# EAGLE design 3w developer v6 (EAGLE 5.12)
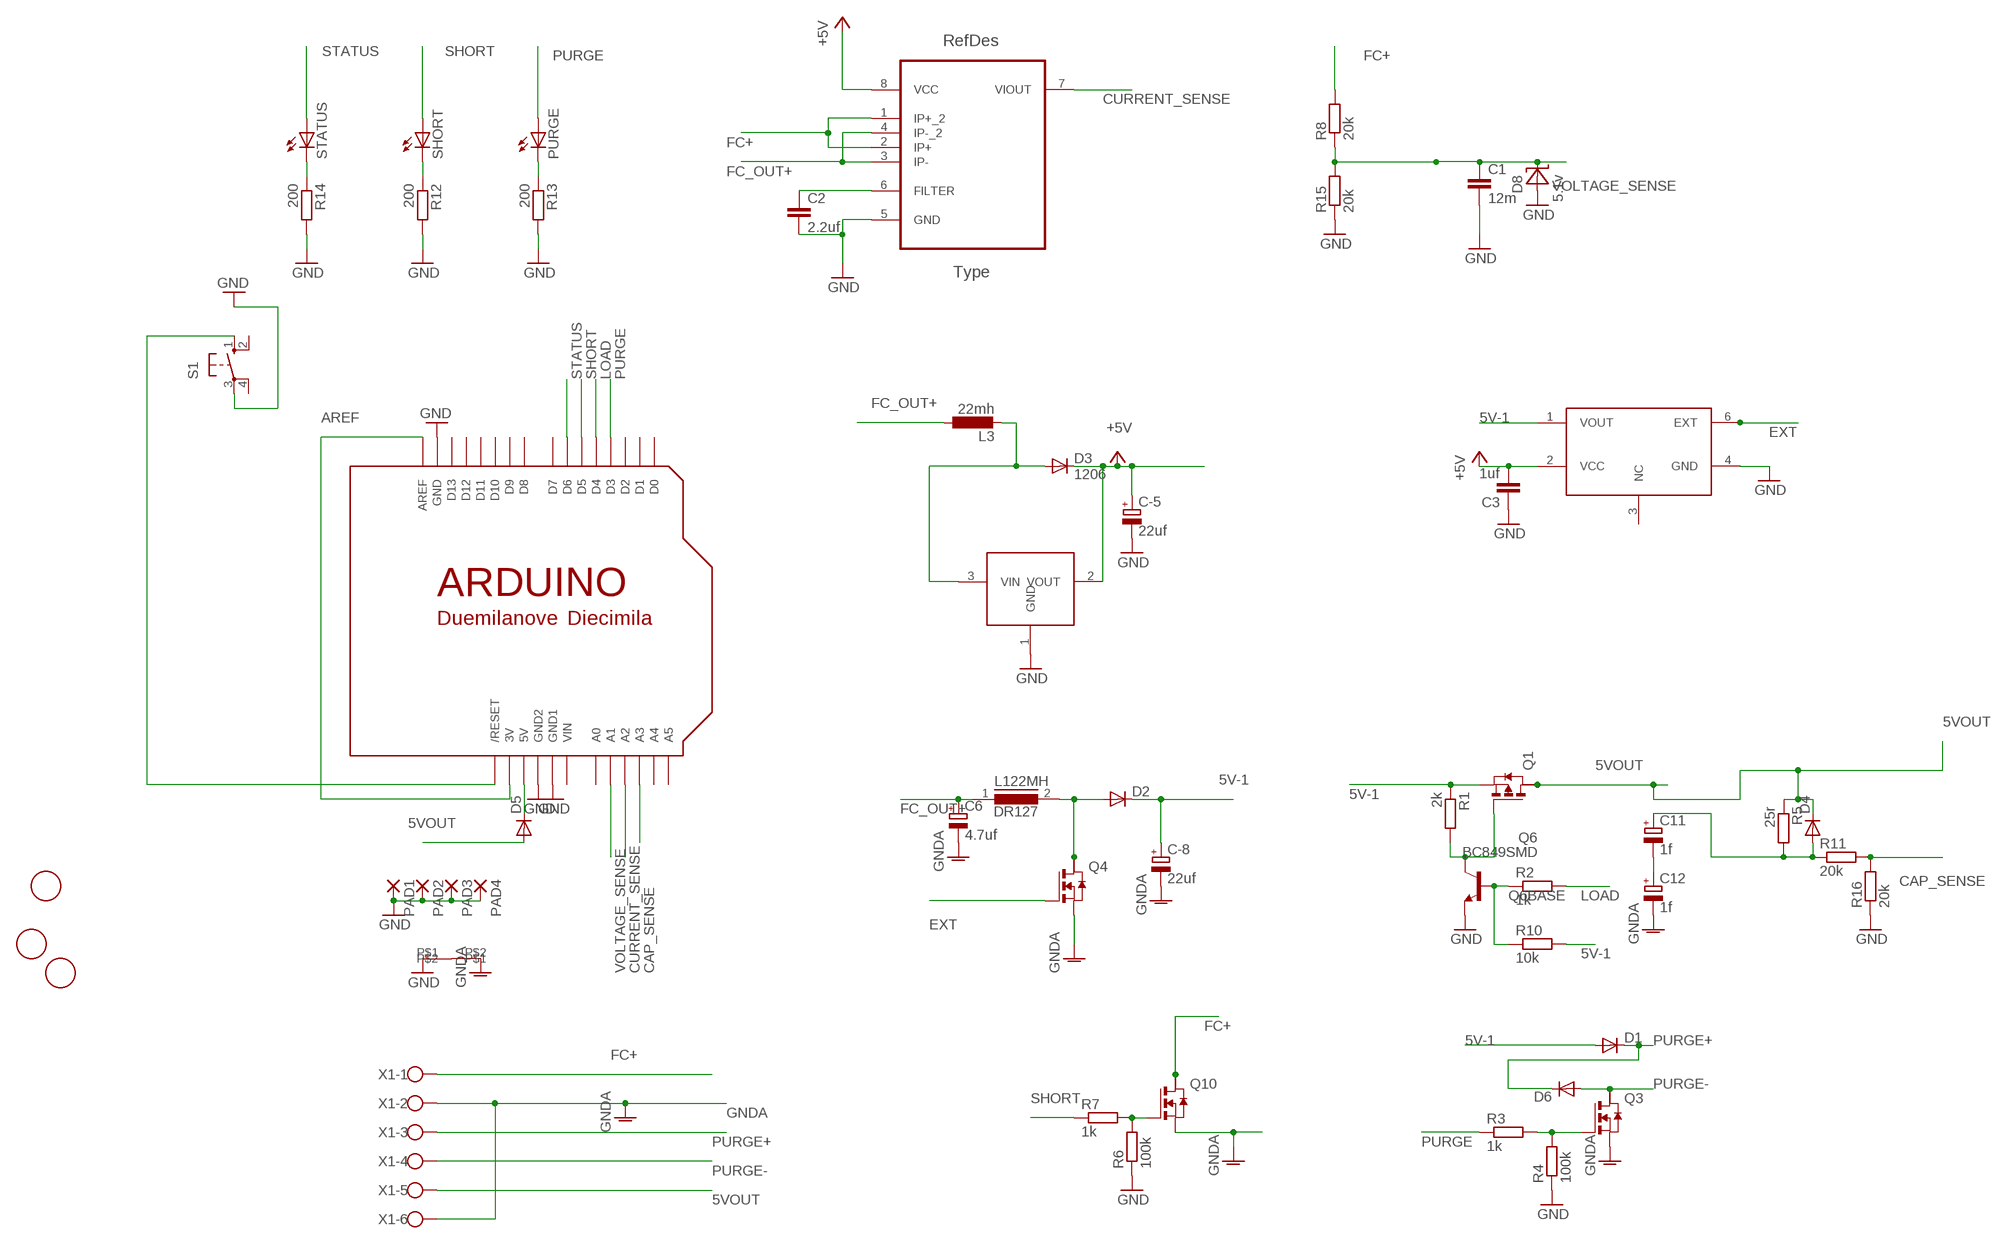
[diagram p0: schematic, sheet 1]

## Parts
C1  12m  C-EUC1206  [C1206]
C2  2.2uf  C-EUC1206  [C1206]
C3  1uf  C-EUC1206  [C1206]
C6  4.7uf  CPOL-EUSMCC  [SMC_C]
C11  1f  CPOL-EUE5-10.5  [E5-10,5]
C12  1f  CPOL-EUE5-10.5  [E5-10,5]
C-5  22uf  CPOL-EUSMCD  [SMC_D]
C-8  22uf  CPOL-EUSMCD  [SMC_D]
D1  DIODE-DO214AA  [DO214AA]
D2  DIODE-DO214BA  [DO214BA]
D3  1206  DIODE-DO214BA  [DO214BA]
D4  DIODE-DO214BA  [DO214BA]
D5  DIODE-DO214BA  [DO214BA]
D6  DIODE-DO214AA  [DO214AA]
D8  5.1v  1206ZENER  [C1206]
L3  22mh  L-EU  [MURATA-45223]
L122MH  DR127  [DR127]
PAD1  1,6/0,8  [1,6/0,8]
PAD2  1,6/0,8  [1,6/0,8]
PAD3  1,6/0,8  [1,6/0,8]
PAD4  1,6/0,8  [1,6/0,8]
PURGE  LEDSMT1206  [1206]
Q1  PMOSSOT223  [SOT223]
Q3  NMOSSOT223  [SOT223]
Q4  NMOSSOT223  [SOT223]
Q6  BC849SMD  [SOT23-BEC]
Q10  NMOSSOT223  [SOT223]
R1  2k  R-EU_M1206  [M1206]
R2  1k  R-EU_M1206  [M1206]
R3  1k  R-EU_M1206  [M1206]
R4  100k  R-EU_M1206  [M1206]
R5  25r  R-EU_R2512  [R2512]
R6  100k  R-EU_M1206  [M1206]
R7  1k  R-EU_M1206  [M1206]
R8  20k  R-EU_R1206  [R1206]
R10  10k  R-EU_M1206  [M1206]
R11  20k  R-EU_M1206  [M1206]
R12  200  R-EU_M1206  [M1206]
R13  200  R-EU_M1206  [M1206]
R14  200  R-EU_M1206  [M1206]
R15  20k  R-EU_R1206  [R1206]
R16  20k  R-EU_M1206  [M1206]
S1  10-XX  [B3F-10XX]
SHORT  LEDSMT1206  [1206]
STATUS  LEDSMT1206  [1206]
U$2  FIDUCIAL  [FIDUCIAL_1MM]
U$3  ARDUINO-NOHOLE  [ARDUINO-NOHOLE]
U$4  SHORT  [SHORT]
U$5  FIDUCIAL  [FIDUCIAL_1MM]
U$6  FIDUCIAL  [FIDUCIAL_1MM]
UC1  MINIPAK-7750  [SOT89]
UC2  MINIPAK-E50  [SOT23-5]
UC3  ACS712ELCTR-05B-T  [SOIC127P600X175-8N]
X1  W237-6  [W237-6]

## Nets
5V-1: C-8.+ D1.A D2.C Q1.3(S) R1.1 R10.2 UC2.1(VOUT)
5VOUT [power]: D4.C D5.A Q1.2(D) R5.1 X1.5
+5V [medpower]: C3.2 C-5.+ D3.C UC1.2(VOUT) UC2.2(VCC) UC3.8(VCC)
AREF: U$3.3V U$3.AREF
CAP_SENSE: R11.2 R16.2 U$3.A3
CURRENT_SENSE: U$3.A2 UC3.7(VIOUT)
EXT: Q4.1(G) UC2.6(EXT)
FC+ [power]: Q10.2(D) R8.2 UC3.1(IP+_2) UC3.2(IP+) X1.1
FC_OUT+ [power]: C6.+ L3.P$1 L122MH.1 UC3.3(IP-) UC3.4(IP-_2)
GND: C1.2 C2.2 C3.1 C-5.- D8.ANODE(A) PAD1.1(P) PAD2.1(P) PAD3.1(P) PAD4.1(P) Q6.E R4.1 R6.1 R12.2 R13.2 R14.2 R15.1 R16.1 S1.3(P) U$3.GND U$3.GND1 U$3.GND2 U$4.P$1 UC1.1(GND) UC2.4(GND) UC3.5(GND)
GNDA [power]: C6.- C12.- C-8.- Q3.3(S) Q4.3(S) Q10.3(S) U$4.P$2 X1.2 X1.6
LOAD: R2.2 U$3.D4
N$1: Q10.1(G) R6.2 R7.2
N$2: Q1.1(G) Q6.C R1.2
N$3: D2.A L122MH.2 Q4.2(D)
N$5: D5.C U$3.5V
N$6: D3.A L3.P$2 UC1.3(VIN)
N$7: Q3.1(G) R3.2 R4.2
N$8 [power]: C11.- C12.+
N$9: C2.1 UC3.6(FILTER)
N$14: R12.1 SHORT.C
N$15: PURGE.C R13.1
N$16: R14.1 STATUS.C
PURGE: PURGE.A R3.1 U$3.D3
PURGE+ [medpower]: D1.C D6.C X1.3
PURGE- [medpower]: D6.A Q3.2(D) X1.4
Q6BASE: Q6.B R2.1 R10.1
RESET: S1.1(S) U$3.RESET(/RESET)
SHORT: R7.1 SHORT.A U$3.D5
STATUS: STATUS.A U$3.D6
VOLTAGE_SENSE: C1.1 D8.CATHODE(C) R8.1 R15.2 U$3.A1
X: C11.+ D4.A R5.2 R11.1
Unconnected: Q1.4(D2) Q3.4(D2) Q4.4(D2) Q10.4(D2) S1.2(S1) S1.4(P1) U$3.A0 U$3.A4 U$3.A5 U$3.D0 U$3.D1 U$3.D2 U$3.D7 U$3.D8 U$3.D9 U$3.D10 U$3.D11 U$3.D12 U$3.D13 UC2.3(NC)

## Power pins joined to a net without a drawn wire
VIN: U$3.VIN

## Library data of the parts
C1-C3 = matt rcl:C-EU: CAPACITOR, European symbol
C6 = rcl:CPOL-EU: POLARIZED CAPACITOR, European symbol
C11 C12 C-5 C-8 = matt rcl:CPOL-EU: POLARIZED CAPACITOR, European symbol
D1-D6 = matt diode:DIODE-: DIODE
D8 = matt diode:1206ZENER
L3 = matt rcl:L-EU: INDUCTOR, European symbol
L122MH = inductors:DR127: High Power Density, High Efficiency, Shielded Inductors Source: coiltronics_dr_series.pdf
PAD1-PAD4 = wirepad:1,6/0,8: THROUGH-HOLE PAD
PURGE SHORT STATUS = matt led:LED: LED OSRAM: - CHIPLED LG R971, LG N971, LY N971, LG Q971, LY Q971, LO R971, LY R971 LH N974, LH R974 LS Q976, LO Q976, LY Q976 LO Q996 - Hyper CHIPLED LW Q18S LB Q993, LB Q99A, LB R99A - SideLED LS A670, LO A670, LY A670, LG A670, LP A670 LB A673, LV A673, LT A673, LW A673 LH A674 LY A675 LS A676, LA A676, LO A676, LY A676, LW A676 LS A679, LY A679, LG A679 - Hyper Micro SIDELED® LS Y876, LA Y876, LO Y876, LY Y876 LT Y87S - SmartLED LW L88C, LW L88S LB L89C, LB L89S, LG L890 LS L89K, LO L89K, LY L89K LS L896, LA L896, LO L896, LY L896 - TOPLED LS T670, LO T670, LY T670, LG T670, LP T670 LSG T670, LSP T670, LSY T670, LOP T670, LYG T670 LG T671, LOG T671, LSG T671 LB T673, LV T673, LT T673, LW T673 LH T674 LS T676, LA T676, LO T676, LY T676, LB T676, LH T676, LSB T676, LW T676 LB T67C, LV T67C, LT T67C, LS T67K, LO T67K, LY T67K, LW E67C LS E67B, LA E67B, LO E67B, LY E67B, LB E67C, LV E67C, LT E67C LW T67C LS T679, LY T679, LG T679 LS T770, LO T770, LY T770, LG T770, LP T770 LB T773, LV T773, LT T773, LW T773 LH T774 LS E675, LA E675, LY E675, LS T675 LS T776, LA T776, LO T776, LY T776, LB T776 LHGB T686 LT T68C, LB T68C - Hyper Mini TOPLED® LB M676 - Mini TOPLED Santana® LG M470 LS M47K, LO M47K, LY M47K Source: http://www.osram.convergy.de LUXEON: - LUMILED® LXK2-PW12-R00, LXK2-PW12-S00, LXK2-PW14-U00, LXK2-PW14-V00 LXK2-PM12-R00, LXK2-PM12-S00, LXK2-PM14-U00 LXK2-PE12-Q00, LXK2-PE12-R00, LXK2-PE12-S00, LXK2-PE14-T00, LXK2-PE14-U00 LXK2-PB12-K00, LXK2-PB12-L00, LXK2-PB12-M00, LXK2-PB14-N00, LXK2-PB14-P00, LXK2-PB14-Q00 LXK2-PR12-L00, LXK2-PR12-M00, LXK2-PR14-Q00, LXK2-PR14-R00 LXK2-PD12-Q00, LXK2-PD12-R00, LXK2-PD12-S00 LXK2-PH12-R00, LXK2-PH12-S00 LXK2-PL12-P00, LXK2-PL12-Q00, LXK2-PL12-R00 Source: www.luxeon.com KINGBRIGHT: KA-3528ASYC Source: www.kingbright.com
Q1 = zetex:PMOSSOT223: MOS FET
Q3 Q4 Q10 = zetex:NMOSSOT223: MOS FET
Q6 = matt transistor-npn:BC849*: NPN Transistor
R1-R4 R6 R7 R10-R14 R16 = resistor:R-EU_: RESISTOR, European symbol
R5 R8 R15 = matt rcl:R-EU_: RESISTOR, European symbol
S1 = switch-omron:10-XX: OMRON SWITCH
U$2 U$5 U$6 = adafruit:FIDUCIAL: For use by pick and place machines to calibrate the vision/machine, 1mm By microbuilder.eu
U$3 = adafruit:ARDUINO: Arduino Diecimila/Duemilanove Make a shield with ease, this package has all the named pins as well as the two mounting drill holes and an outline of the USB and DC power connector. The outline is on the DIMENSION layer, so if your board house uses it they will cut the outline to match. http://www.ladyada.net/library/pcb/eaglelibrary.html
U$4 = matt:SHORT
UC1 = matt:MINIPAK-7750
UC2 = matt:MINIPAK-E50
UC3 = matt-allegro:ACS712ELCTR-05B-T: Linear Current Sensor; DESCRIPTION: Linear Current Sensor; MPN: ACS712ELCTR-05B-T; OC_FARNELL: 27M3644; OC_NEWARK: 1329623; PACKAGE: SOIC-8; SUPPLIER: Allegro
X1 = con-wago-500:W237-6: WAGO SCREW CLAMP

## Net classes
1 power: width 3 mm
2 medpower: width 1 mm

## Board
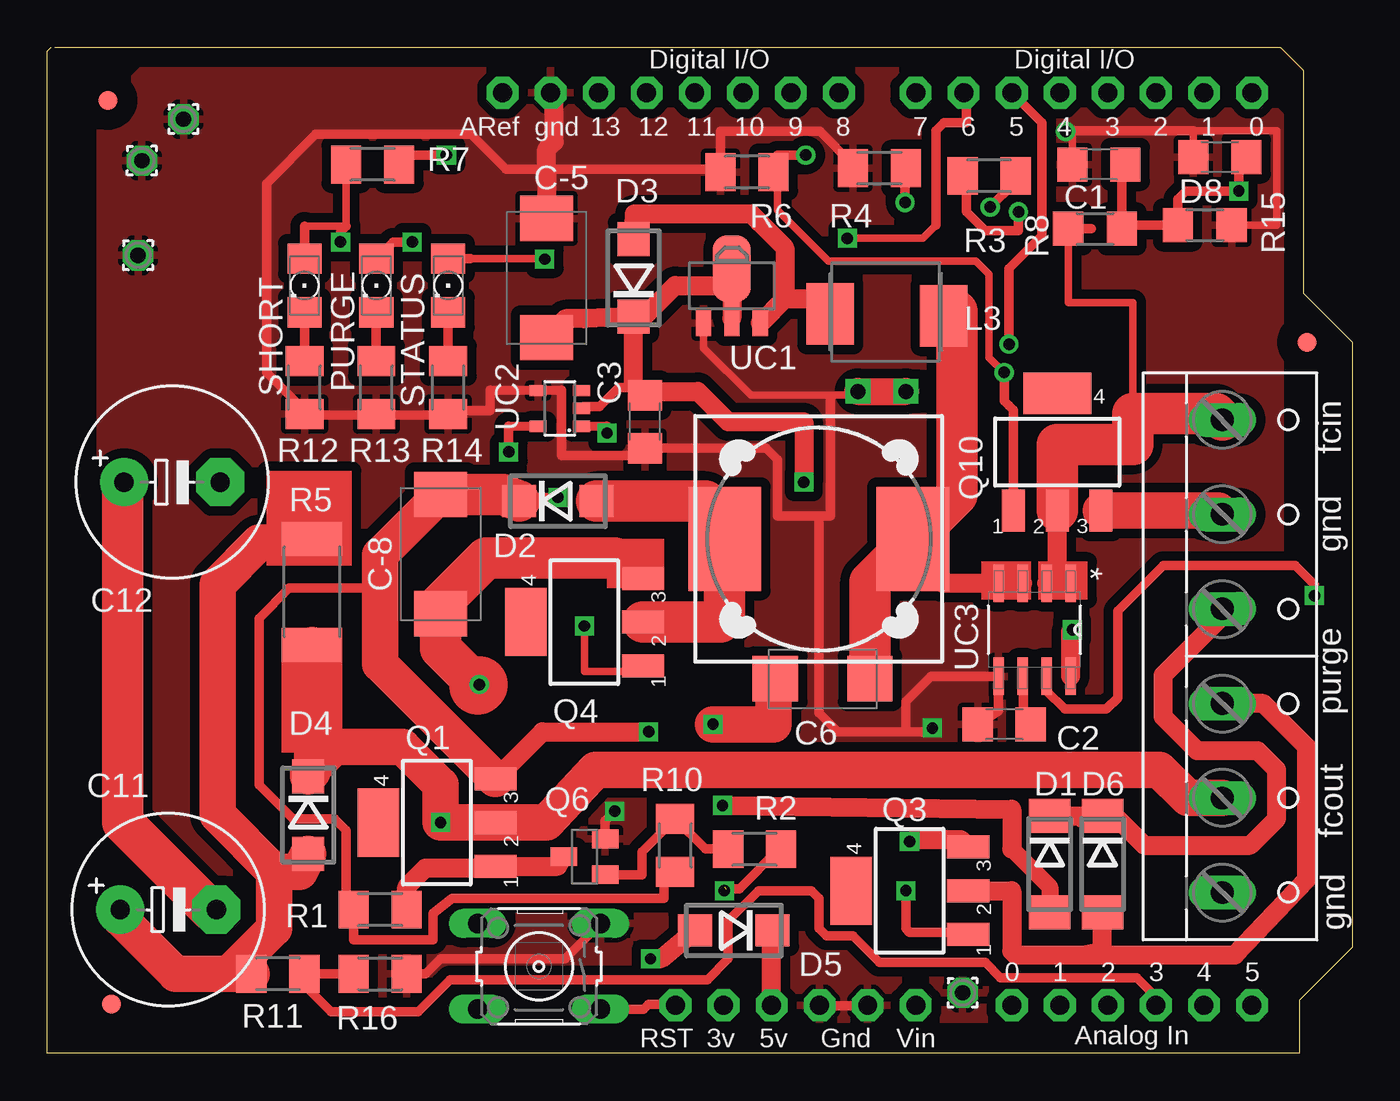
[diagram p1: board, top side]
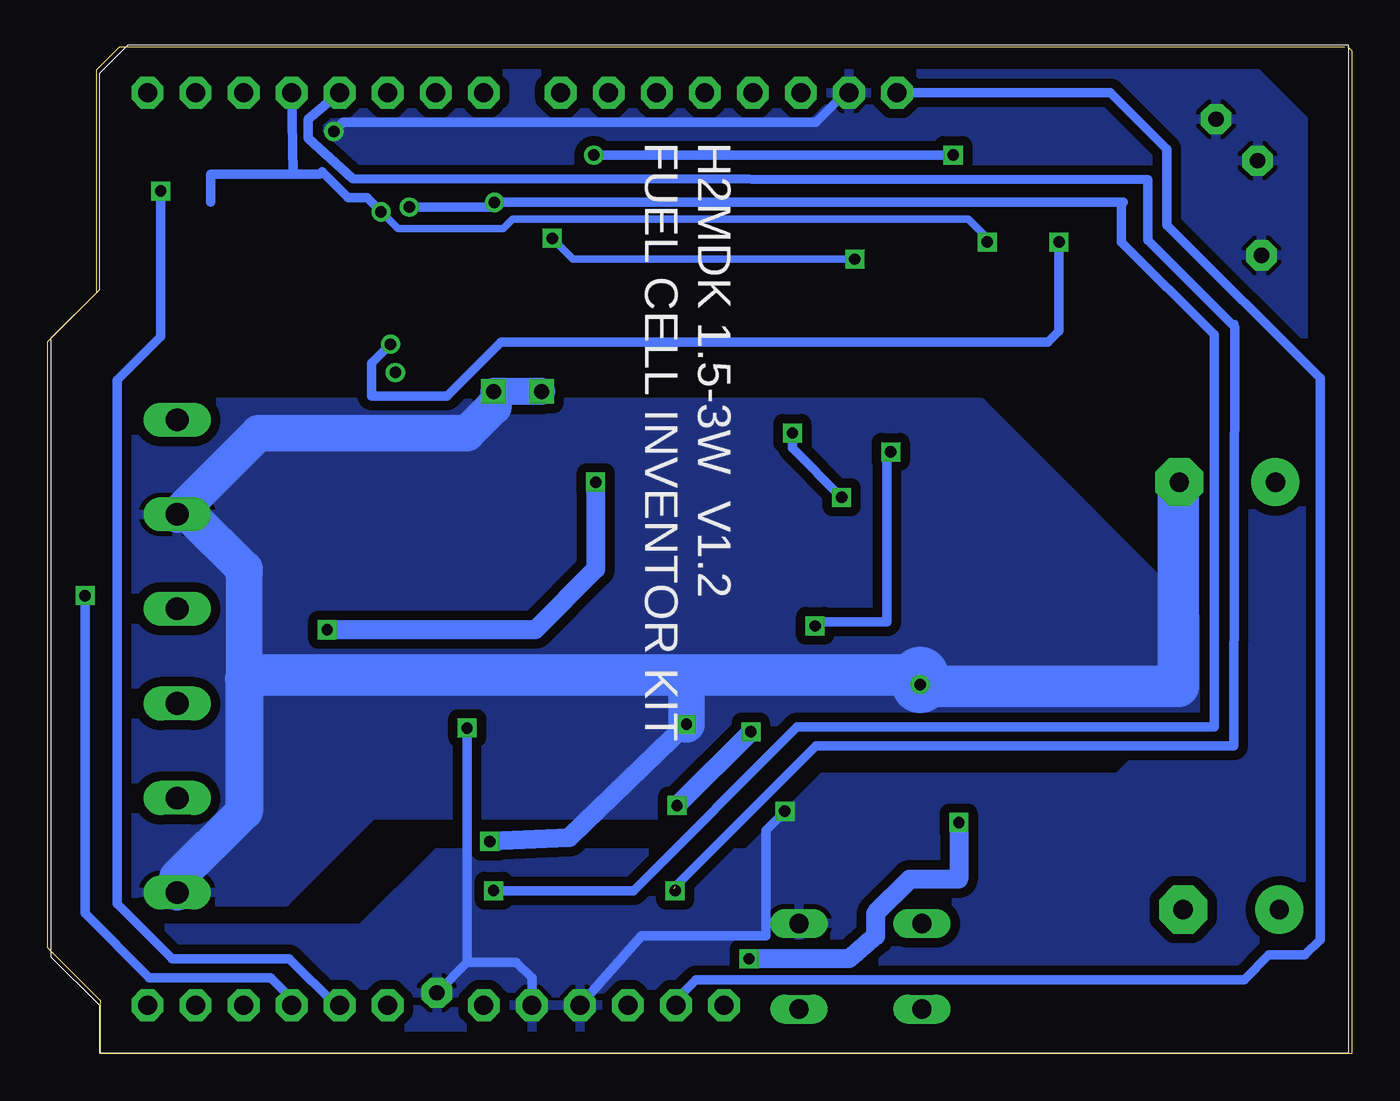
[diagram p2: board, bottom side, seen from below]

Size 69 x 53.2 mm. Coordinates in mm from the lower left corner, seen from the top.
Outline: 0.4,53.2 65.2,53.2 66.4,52 66.4,40.2 69,37.6 69,5.6 66.2,2.8 66.2,0 0,0 0,53 0.2,53.2
Copper layers (1*16): Top 0.035mm / dielectric 1.5mm / Bottom 0.035mm
Design rules "default *": minimum track width 20mil, minimum drill 24mil, track to track 10mil, track to pad 10mil, pad to pad 10mil, via to via 10mil, smd to smd 10mil, copper to edge 40mil, drill to drill 8mil, minimum pad ring 10mil, minimum via ring 8mil, stop-mask expansion 4mil, vias tented up to drill 0mil, thermal gap 10mil

### Footprints (pad centres in the part's own frame; a part is rotated, then mirrored left to right if it is on the bottom)
C1206 = smd 1.6 x 1.8: 1 -1.4,0; 2 1.4,0
SMC_C = smd 2.4 x 2.4: + -2.5,0; - 2.5,0
E5-10,5 = drill 1.016 pad 2.54 round: + -2.54,0 | drill 1.016 pad 2.54 octagon: - 2.54,0
SMC_D = smd 2.4 x 2.8: + -3.15,0; - 3.15,0
DO214AA = smd 1.8 x 2.2: A 2.55,0; C -2.55,0
DO214BA = smd 1.8 x 1.7: A 2.05,0; C -2.05,0
C1206' = smd 1.6 x 1.8: ANODE -1.4,0; CATHODE 1.4,0
MURATA-45223 = smd 2.5 x 3.25: P$1 -3.6,0.2; P$2 2.4,0.1
DR127 = smd 3.85 x 5.5: 1 -4.975,0; 2 4.975,0
1,6/0,8 = drill 0.813 pad 1.6 octagon: 1 0,0
1206 = smd 1.6 x 1.803: A -1.422,0; C 1.422,0
SOT223 = smd 1.219 x 2.235: 1 -2.311,-3.099; 2 0,-3.099; 3 2.311,-3.099 | smd 3.6 x 2.2: 4 0,3.099
SOT23-BEC = smd 1 x 1.4: B -0.95,-1.1; C 0,1.1; E 0.95,-1.1
M1206 = smd 1.6 x 2: 1 -1.4,0; 2 1.4,0
R2512 = smd 1.8 x 3.2: 1 -2.8,0; 2 2.8,0
R1206 = smd 1.6 x 1.803: 1 -1.422,0; 2 1.422,0
B3F-10XX = drill 1.016 long: 1 -3.251,2.261; 2 3.251,2.261; 3 -3.251,-2.261; 4 3.251,-2.261
FIDUCIAL_1MM = smd 1 x 1: 1 0,0
ARDUINO-NOHOLE = drill 1 pad 1.676 octagon: 3V 35.56,2.54; 5V 38.1,2.54; A0 50.8,2.54; A1 53.34,2.54; A2 55.88,2.54; A3 58.42,2.54; A4 60.96,2.54; A5 63.5,2.54; AREF 23.876,50.8; D0 63.5,50.8; D1 60.96,50.8; D2 58.42,50.8; D3 55.88,50.8; D4 53.34,50.8; D5 50.8,50.8; D6 48.26,50.8; D7 45.72,50.8; D8 41.656,50.8; D9 39.116,50.8; D10 36.576,50.8; D11 34.036,50.8; D12 31.496,50.8; D13 28.956,50.8; GND 26.416,50.8; GND1 43.18,2.54; GND2 40.64,2.54; RESET 33.02,2.54; VIN 45.72,2.54
SHORT = drill 0.8 square: P$1 -2.54,0; P$2 0,0
SOT89 = smd 0.8 x 1.4: 1 -1.499,-1.981; 3 1.499,-1.981 | smd 0.8 x 1.9: 2 0,-1.727 | smd 2 x 3.5: 2.1 0,0.889
SOT23-5 = smd 0.6 x 0.9: 1 -0.95,-1.15; 2 0,-1.15; 3 0.95,-1.15; 4 0.95,1.15; 6 -0.95,1.15
SOIC127P600X175-8N = smd 1.981 x 0.559: 1 -2.464,1.905; 2 -2.464,0.635; 3 -2.464,-0.635; 4 -2.464,-1.905; 5 2.464,-1.905; 6 2.464,-0.635; 7 2.464,0.635; 8 2.464,1.905
W237-6 = drill 1.194 long: 1 -12.5,-1.27; 2 -7.5,-1.27; 3 -2.5,-1.27; 4 2.5,-1.27; 5 7.5,-1.27; 6 12.5,-1.27

### Placement (x,y rotation side)
C1  55.6,47 180 top
C2  50.6,17.4 180 top
C3  31.6,33.4 90 top
C6  41,19.8 180 top
C11  6.4,7.6 0 top
C12  6.6,30.2 0 top
C-5  26.4,41 90 top
C-8  20.8,26.4 270 top
D1  53,10 270 top
D2  27,29.2 0 top
D3  31,41 90 top
D4  13.8,12.6 270 top
D5  36.3,6.5 180 top
D6  55.8,10 270 top
D8  5.1v  [C1206']  62,47.4 0 top
L3  43.8,39.2 180 top
L122MH  40.8,27.2 180 top
PAD1  7.2,49.4 0 top
PAD2  5,47.2 0 top
PAD3  4.8,42.2 0 top
PAD4  48.4,3.2 0 top
PURGE  17.4,40.6 270 top
Q1  20.6,12.2 90 top
Q3  45.6,8.6 90 top
Q4  28.4,22.8 90 top
Q6  28.4,10.4 90 top
Q10  53.4,31.8 0 top
R1  17.6,7.6 0 top
R2  37.4,10.8 0 top
R3  49.8,46.4 0 top
R4  44,46.8 0 top
R5  14,24.4 90 top
R6  37,46.6 0 top
R7  17.2,47 0 top
R8  55.4,43.6 180 top
R10  33.2,11 270 top
R11  12.2,4.2 0 top
R12  13.6,35.2 270 top
R13  17.4,35.2 270 top
R14  21.2,35.2 270 top
R15  61.2,43.8 180 top
R16  17.6,4.2 180 top
S1  26,4.6 180 top
SHORT  13.6,40.6 270 top
STATUS  21.2,40.6 270 top
U$1  [FABLABLOGO]  59.6,6 90 top
U$2  3.2,50.4 0 top
U$3  0.2,0 0 top
U$4  45.4,35 0 top
U$5  3.4,2.6 0 top
U$6  66.6,37.6 0 top
UC1  36.2,40.6 0 top
UC2  27.1,34.1 90 top
UC3  52.2,22.4 270 top
X1  63.4,21 270 top

### Tracks (layer width: path | path; a pad name or v marks a point on that pad's centre or on a via)
5V-1  (via drill 0.6)
  Top 0.5: 17.6,24.4 17.4,24.6 12.8,24.6 11.2,23 11.2,14.2 13,12.4 15.2,12.4 15.8,11.8 15.8,8 R1.1 16.2,6 20.4,6 20.4,7.4 21.4,8.2 32.6,8.2 32.6,9 R10.2 | UC2.1 29.58,33.18 v29.6,32.8 | v27,29.4 24.65,29.4 D2.C
  Top 0.9: D1.A 53,8.8 51,10.8
  Top 1: v35.7,13.1 51,12.9 51,10.8
  Top 1.016: v31.8,17 26.19,17 Q1.3
  Top 1.93: Q1.3 23.69,14.51 17.6,20.6 17.6,24.4 17.6,26.35 C-8.+
  Top 2.184: C-8.+ 24.1,29.55 D2.C
  Bottom 0.5: v29.6,32.8 29.6,32 v27,29.4
  Bottom 1.016: v31.8,17 v35.7,13.1
5VOUT  (via drill 0.6)
  Top 1.016: v31.9,5 32.45,5 D5.A
  Top 1.93: X1.5 60.3,13.5 58.8,15 29,15 26.4,12.2 Q1.2 v20.8,12.2 20.8,14.2 18.8,16.2 15.2,16.2 13.8,14.8 D4.C 14,14.85 R5.1
  Bottom 1.016: v20.8,12.2 20.8,9.2 23.4,9.2 25.2,7.4 25.2,6.2 26.6,5 v31.9,5
+5V  (via drill 0.6)
  Top 0.4: 31.2,35.2 C3.2
  Top 0.406: UC2.2 28.35,34.2 | 28.4,38.85 28.2,39.05
  Top 0.5: 31.2,35.2 30.2,35.2 29.2,34.2 28.35,34.2
  Top 1.016: D3.C 28.4,38.85 27.4,38.85 C-5.+ | D3.C 31,35.4 31.2,35.2 | D3.C 31.45,38.85 33.2,40.6 36.2,40.6 UC1.2 | UC3.8 54.1,22.3 v54.2,22.4 | v40,30.2 40,33.4 36,33.4 34.4,35 31.8,35 C3.2
  Bottom 1.016: v54.2,22.4 43.2,22.4 40,25.6 v40,30.2
AREF
  Bottom 0.5: U$3.3V 35.76,2.84 34.7,3.9 5.7,3.9 4.4,5.2 2.5,5.2 1.7,6 1.7,35.7 9.8,43.8 9.8,47.8 12.8,50.8 U$3.AREF
CAP_SENSE
  Top 0.406: 21.3,3.9 21.4,3.9
  Top 0.5: 58.62,2.42 U$3.A3 58.62,2.98 57.6,4 50.4,4 49.6,4.8 44,4.8 42.6,6.2 41.2,6.2 40.8,6.6 40.8,8.2 40.4,8.6 37.6,8.6 36,7 36,5 34.9,3.9 21.4,3.9 | 21.3,3.9 19.6,2.2 15,2.2 13.6,3.6 R11.2 R16.2
CURRENT_SENSE  (via drill 0.6)
  Top 0.406: 52.83,19.17 UC3.7
  Top 0.5: 52.83,19.17 53.8,18.2 56,18.2 56.6,18.8 56.6,23.4 59,25.8 66,25.8 67,24.8 v67,24.2
  Bottom 0.406: U$3.A2 56.08,2.88
  Bottom 0.5: 56.08,2.88 57.2,4 63.6,4 67,7.4 v67,24.2
EXT  (via drill 0.6)
  Top 0.406: v28.4,22.6 28.4,20.2 31.5,20.2 Q4.1
  Top 0.5: UC2.6 24.4,33.18 v24.4,31.8
  Bottom 0.406: 24.6,31.8 v24.4,31.8 | 28.4,22.8 v28.4,22.6
  Bottom 0.5: 24.6,31.8 24.6,22.8 28.4,22.8
FC+
  Top 0.406: 57.4,33.4 57.4,33.83 57.4,39.7 53.98,39.7 R8.2
  Top 0.5: R8.2 55.2,43.6
  Top 1.016: Q10.2 53.4,25.2 53.6,25 52.97,25 UC3.2 UC3.1
  Top 2.184: 57.4,33.4 57.4,32.2 53.4,32.2 Q10.2 | X1.1 61.8,33.83 57.4,33.83
FC_OUT+
  Top 0.406: 48.1,39.25 47.4,39.25 L3.P$1 47.2,39.8 47.2,39.75 47.6,39.75
  Top 1.016: UC3.3 51.5,24.8 50.4,24.8 50.34,24.86 UC3.4 47.34,24.86 45.39,26.81
  Top 2.184: C6.+ 43.5,24.93 45.39,26.81 L122MH.1 48.1,29.53 48.1,39.25
GND  (via drill 0.6, 0.61)
  Top 0.406: 21.2,34 R14.2 | C3.1 31.2,31.6 | C1.2 54.2,48.75 v53.85,48.75 53.85,48.8 | D8.ANODE 60.6,48.8 65,48.8 65,43.8 R15.1 | UC1.1 34.7,37.3 37.2,34.8 41.6,34.8 | 41.6,34.8 42.66,34.8 U$4.P$1 | 41.4,34.6 41.6,34.8 | 40.8,28.2 41,28.4
  Top 0.5: 40.85,2.5 43.35,2.5 | 13.6,34 11.6,36 11.6,46 14.2,48.6 22.4,48.6 24.25,46.75 26.1,46.75 | 21.2,34 23.4,34 23.4,35.08 UC2.4 27.2,35.08 27.2,31.6 31.2,31.6 | 53.85,48.8 60.6,48.8 | C3.1 38,32 38.6,31.4 38.6,28.4 41,28.4 41.4,28.4 41.4,34.6 | 45.4,17 45.4,18.6 46.74,19.94 UC3.5 50.29,18.1 C2.2 | 45.4,17 41.8,17 40.8,18 40.8,28.2 | 30,12.95 v30,12.8 29.5,12.3 Q6.E | 45.4,17 46.6,17 v46.8,17.2 | R16.1 20,4.2 20.8,5 27.39,5 S1.3
  Top 0.508: 40.85,2.5 U$3.GND2 40.6,2.75 | 43.35,2.5 U$3.GND1 | R14.2 21.1,33.75 17.6,33.75 R13.2 17.35,33.75 13.6,33.75 R12.2 13.6,34 | C1.2 54.35,47 | R4.1 42.6,47 40.85,48.75 35.6,48.75 R6.1 35.6,46.75 26.4,46.75 26.1,46.75 | 54.1,47.25 53.85,47.5
  Top 1.016: C-5.- 26.4,46.75 26.4,47.8 26.8,48.2 26.8,50.62 U$3.GND
  Bottom 0.406: U$3.GND1 43.38,3.18
  Bottom 0.5: U$3.GND2 37.58,6.2 31,6.2 31,6.86 | S1.3 31,6.86 | 46.8,4.8 v46.8,17.2 | 46.8,4.8 PAD4.1 | U$3.GND1 43.38,3.98 44.2,4.8 46.8,4.8 | 31,6.86 31,11.8 v30,12.8
  Bottom 0.508: v53.85,48.75 53.35,49.25 28.35,49.25 26.85,50.75 U$3.GND
  Bottom 1.016: U$3.GND1 43.4,2.56
  pour Bottom (isolate 0.5): 65,36.2 65,51.2 64.4,51.8 5,51.8 2.6,49.4 2.6,3.8 5,1.4 63,1.4 66.2,4.6 66.2,5.8 65.4,6.6 52.4,6.6 48.4,10.6 32,10.6 28,14.6 12.4,14.6 8.4,18.6 8.4,25.8 18.8,36 64.6,36 64.8,36.2
  pour Top (isolate 0.5): 2.8,3.8 2.8,49.8 5,52 62.8,52 65.2,49.6 65.2,3.8 63.2,1.8 5,1.8 3,3.8
GNDA  (via drill 0.6, 0.61)
  Top 0.406: 38.4,19.7 C6.- | X1.2 61.93,28.7
  Top 0.813: 30,26.2 30.41,26.2 Q4.3
  Top 1.016: v45.6,11.2 45.8,11.31 48.3,11.31 Q3.3
  Top 1.93: v35.2,17.4 38.4,17.4 38.4,19.7 | 61.93,28.7 Q10.3
  Top 2.184: 30,26.2 23.2,26.2 20.8,23.8 C-8.- 20.8,21.4 22.78,19.43
  Top 3: v22.85,19.5 22.78,19.43
  Bottom 0.406: 45.4,34.2 U$4.P$2
  Bottom 1.016: 61.5,28.5 X1.2 | v45.6,11.2 41.4,11.4 v35.2,17.4
  Bottom 1.93: 58.6,19.8 58.6,25.4 | 35.2,20 v35.2,17.4 | 58.6,25.6 61.5,28.5 | 45.4,34.2 46.8,32.8 57.83,32.8 X1.2 | X1.6 62.13,9.27 58.6,12.8
  Bottom 2: 58.6,12.8 58.6,19.8 58.4,20 | 58.6,25.4 58.6,25.6
  Bottom 2.184: 23,20 22.85,20 | 23,20 35.2,20 58.4,20 | C12.- 9.2,30.2 9.2,19.4 23,19.4 23,20
  Bottom 3: 22.85,20 v22.85,19.5
  pour Bottom (isolate 0.5, rank 2): 67.8,34.4 19.6,34.4 7.6,22.4 7.6,17.8 12.8,12.6 51.8,12.6 56.4,8 64,8 65.4,9.4 65.4,13.6 67.8,16
LOAD  (via drill 0.6)  (1 unrouted)
  Top 0.5: R2.2 38.7,10.8 36.6,8.7 35.9,8.7 v35.8,8.6
  Bottom 0.406: 6.2,38.4 6.2,38.6
  Bottom 0.5: 6.25,16.25 6.2,38.4 10.8,43 10.8,46.2 | 52.85,46.25 55.2,48.4 55.2,49.4 U$3.D4 | 21.6,16.25 28.35,16.25 35.8,8.8
  Bottom 0.508: 6.25,16.25 21.6,16.25 | 10.8,46.2 52.85,46.25
N$1  (via drill 0.6, 0.61)
  Top 0.406: 38.6,46.5 38.6,44.6 41.3,41.9 49.1,41.9 49.8,41.2 49.8,36.8 v50.6,36
  Top 0.5: Q10.1 51.09,34.01 50.85,34.25 | v21.1,47.5 19.1,47.5 R7.2
  Top 0.508: v40.1,47.5 38.6,47.5 38.6,46.75 R6.2 38.6,46.5 | 50.85,34.25 50.6,34.5 v50.6,36
  Bottom 0.508: v21.1,47.5 v40.1,47.5
N$2
  Top 1.016: Q6.C 26.99,9.89 Q1.1 23.61,9.8 20,9.8 19,8.8 R1.2
N$3
  Top 1.778: 35.8,27.18 L122MH.2
  Top 2.184: Q4.2 35.6,22.8 35.8,23 35.8,27.18 | L122MH.2 35.8,27.23 35.8,28.6 35.6,28.4 34.8,29.2 D2.A
N$5
  Top 1: U$3.5V 38.3,6.55 D5.C
N$6
  Top 1: 37.65,43.95 37.2,44.4 31.05,44.4 D3.A
  Top 1.016: 39.2,39.9 38.98,39.9 UC1.3 | 37.65,43.95 39,42.6 39,40.1 39.2,39.9 | 39.2,39.9 40.6,39.9 L3.P$2
N$7  (via drill 0.6, 0.61)
  Top 0.5: v45.4,8.6 45.4,6.6 45.6,6.4 48.59,6.4 Q3.1
  Top 0.508: v45.35,45 45.35,46.75 R4.2 | v49.85,44.75 51.1,46 51.1,46.25 R3.2
  Bottom 0.5: 45.6,44.75 v49.85,44.75 | v45.4,8.6 38,8.6 29.35,17.25 7.3,17.25 7.3,38 12.2,42.9 12.2,44.9 12.1,45 17.1,45
  Bottom 0.508: 45.6,44.75 v45.35,45 17.1,45
N$8
  Top 2.184: C11.- 8.6,7.6 4,12.2 4,30.14 C12.+
N$9
  Top 0.406: 52.6,17.6 C2.1 51.6,17.4 | 51.6,19.9 UC3.6
  Top 0.5: 51.6,17.4 51.6,19.9
N$14
  Top 0.5: R12.1 SHORT.C
N$15
  Top 0.5: R13.1 PURGE.C
  Top 0.508: R13.1 17.6,36.75
N$16
  Top 0.5: R14.1 STATUS.C
  Top 0.508: R14.1 21.35,36.75
PURGE  (via drill 0.6, 0.61)
  Top 0.5: 48.6,44.5 49.6,43.5 51.35,43.5 | v19.3,42.9 18.28,42.9 PURGE.A
  Top 0.508: 48.6,44.5 48.6,46.25 R3.1 | v51.35,44.5 51.35,43.5
  Bottom 0.406: 19.35,42.85 19.35,43.15 20.3,44.1 44.4,44.1 44.9,43.6 50.45,43.6 v51.35,44.5
  Bottom 0.5: v51.35,44.5 52.1,45.25 53.1,45.25 54.47,46.62 | 60.35,45 60.35,46.5 56,46.5 | 54.6,46.5 56,46.5 | 56,46.5 U$3.D3 | v19.3,42.9 19.35,42.85
  Bottom 0.508: 54.47,46.62 54.6,46.5
PURGE+
  Top 0.406: 62.13,23.13 X1.3 | D6.C 54.75,12.4
  Top 1.016: D1.C D6.C | 62.13,23.13 59,20 59,17.8 60.8,16 64,16 65,15 65,12.4 63.6,11 58,11 56.6,12.4 54.75,12.4
PURGE-
  Top 1.016: 54.8,5.2 62.8,5.2 66.6,9.2 66.6,16.2 64.3,18.5 X1.4 | D6.A 55.8,5.4 54.8,5.2 | 54.8,5.2 51.2,5.2 51,5.4 51,8.6 Q3.2
Q6BASE
  Top 0.406: Q6.B 29.45,9.2
  Top 0.5: Q6.B 31.45,9.45 31.45,10.65 R10.1 34.8,10.8 R2.1
RESET
  Top 0.406: U$3.RESET
  Top 0.5: S1.1 31.54,2.34 31.8,2.6 33.16,2.6 U$3.RESET
SHORT  (via drill 0.6, 0.61)
  Top 0.406: 13.6,43.75 15.8,43.75 R7.1
  Top 0.5: 52.6,43.25 52.6,49.2 U$3.D5 | 13.6,43.75 SHORT.A | v15.5,42.9 15.5,43.45 15.8,43.75
  Top 0.508: 52.6,43.25 50.85,41.5 v50.85,37.5
  Bottom 0.5: 45,37.6 16.1,37.6 15.5,38.2 v15.5,42.9
  Bottom 0.508: v50.85,37.5 51.85,36.5 51.85,34.75 47.85,34.75 45,37.6
STATUS  (via drill 0.6)
  Top 0.406: 48.6,50.8 U$3.D6 | v42.3,43.1 46.3,43.1 47,43.8 | 22.38,42.02 26.28,42.02 v26.3,42
  Top 0.5: 48.6,50.8 48.6,49.2 47.4,49.2 47,48.8 47,43.8 | STATUS.A 22.38,42.02
  Bottom 0.406: v26.3,42 41.2,42 v42.3,43.1
VOLTAGE_SENSE  (via drill 0.6)
  Top 0.406: 63,47 D8.CATHODE | C1.1 57,46.62 | R15.2 59.18,43.8
  Top 0.5: C1.1 56.82,46.82 R8.1 57.02,43.8 R15.2 59.78,45.18 60.2,45.6 v63,45.6 63,47
  Bottom 0.406: U$3.A1 53.74,2.54
  Bottom 0.5: 53.74,2.54 56.2,5 62.4,5 65.3,7.9 65.3,35.6 63,37.9 v63,45.6
X
  Top 1.016: 3.86,7.14 C11.+
  Top 1.93: R5.2 13.8,27 11.2,27 9,24.8 9,12.6 12,9.6 | 9.6,4.2 6.8,4.2 3.86,7.14 | 9.6,4.2 R11.1 | 9.6,4.2 12,6.6 12,9.6 | 12,9.6 13.35,9.6 D4.A
(copper drawn outside any net)
  shapes: Top area x5

### Text on the board
tPlace: purge
tNames: fcin | gnd | fcout | gnd
bNames: H2MDK 1.5-3W V1.2 | FUEL CELL INVENTOR KIT